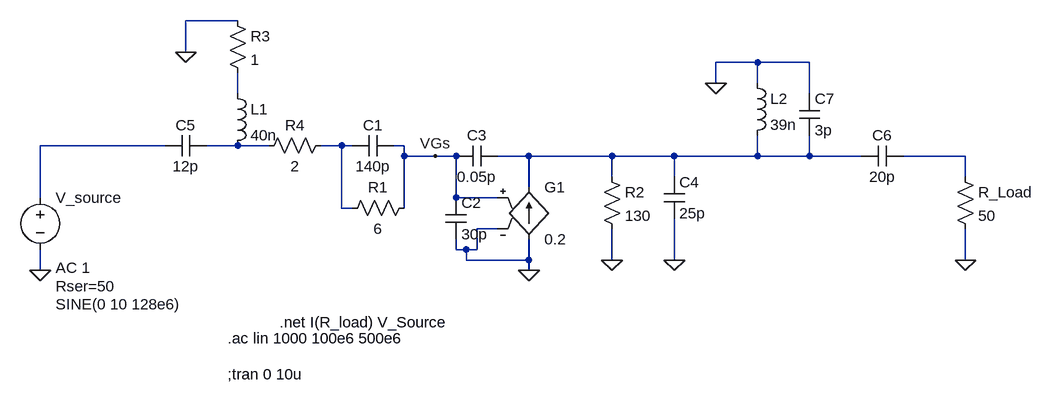
[diagram p0: schematic Stage2_MRFE6VS25N_Linear_Model.asc]
Stage2_MRFE6VS25N_Linear_Model.asc, the LTspice schematic file:
Version 4
SHEET 1 1280 680
WIRE 48 -144 -32 -144
WIRE -32 -96 -32 -144
WIRE 848 -80 784 -80
WIRE 928 -80 848 -80
WIRE 784 -48 784 -80
WIRE 848 -48 848 -80
WIRE 48 -32 48 -64
WIRE 928 -32 928 -80
WIRE -64 48 -256 48
WIRE 48 48 0 48
WIRE 96 48 48 48
WIRE 208 48 176 48
WIRE 224 48 208 48
WIRE 304 48 288 48
WIRE 304 64 304 48
WIRE 352 64 304 64
WIRE 384 64 352 64
WIRE 496 64 448 64
WIRE 624 64 496 64
WIRE 720 64 624 64
WIRE 848 64 848 32
WIRE 848 64 720 64
WIRE 928 64 928 32
WIRE 928 64 848 64
WIRE 1008 64 928 64
WIRE 1168 64 1072 64
WIRE 624 96 624 64
WIRE 720 96 720 64
WIRE 1168 96 1168 64
WIRE 496 112 496 64
WIRE -256 128 -256 48
WIRE 384 128 384 64
WIRE 448 128 384 128
WIRE 208 144 208 48
WIRE 224 144 208 144
WIRE 304 144 304 64
WIRE 448 176 416 176
WIRE 384 208 384 192
WIRE 400 208 384 208
WIRE 416 208 416 176
WIRE 416 208 400 208
WIRE 400 224 400 208
WIRE 496 224 496 192
WIRE 496 224 400 224
WIRE 624 224 624 176
WIRE 720 224 720 160
WIRE 1168 224 1168 176
WIRE -256 240 -256 208
WIRE 496 240 496 224
FLAG -256 240 0
FLAG 496 240 0
FLAG 624 224 0
FLAG 720 224 0
FLAG 1168 224 0
FLAG 352 64 VGs
FLAG -32 -96 0
FLAG 784 -48 0
SYMBOL voltage -256 112 R0
WINDOW 3 24 180 Left 2
WINDOW 123 24 124 Left 2
WINDOW 39 24 152 Left 2
SYMATTR Value SINE(0 10 128e6)
SYMATTR Value2 AC 1
SYMATTR SpiceLine Rser=50
SYMATTR InstName V_source
SYMBOL cap 288 32 R90
WINDOW 0 0 32 VBottom 2
WINDOW 3 32 32 VTop 2
SYMATTR InstName C1
SYMATTR Value 140p
SYMBOL res 320 128 R90
WINDOW 0 0 56 VBottom 2
WINDOW 3 32 56 VTop 2
SYMATTR InstName R1
SYMATTR Value 6
SYMBOL cap 368 128 R0
SYMATTR InstName C2
SYMATTR Value 30p
SYMBOL cap 448 48 R90
WINDOW 0 0 32 VBottom 2
WINDOW 3 32 32 VTop 2
SYMATTR InstName C3
SYMATTR Value 0.05p
SYMBOL res 608 80 R0
SYMATTR InstName R2
SYMATTR Value 130
SYMBOL cap 704 96 R0
SYMATTR InstName C4
SYMATTR Value 25p
SYMBOL res 1152 80 R0
SYMATTR InstName R_Load
SYMATTR Value 50
SYMBOL g 496 96 R0
SYMATTR InstName G1
SYMATTR Value 0.2
SYMBOL ind 32 -48 R0
SYMATTR InstName L1
SYMATTR Value 40n
SYMBOL cap 0 32 R90
WINDOW 0 0 32 VBottom 2
WINDOW 3 32 32 VTop 2
SYMATTR InstName C5
SYMATTR Value 12p
SYMBOL ind 832 -64 R0
SYMATTR InstName L2
SYMATTR Value 39n
SYMBOL cap 1072 48 R90
WINDOW 0 0 32 VBottom 2
WINDOW 3 32 32 VTop 2
SYMATTR InstName C6
SYMATTR Value 20p
SYMBOL res 32 -160 R0
SYMATTR InstName R3
SYMATTR Value 1
SYMBOL res 192 32 R90
WINDOW 0 0 56 VBottom 2
WINDOW 3 32 56 VTop 2
SYMATTR InstName R4
SYMATTR Value 2
SYMBOL cap 912 -32 R0
SYMATTR InstName C7
SYMATTR Value 3p
TEXT 112 320 Left 2 !.net I(R_load) V_Source
TEXT 32 344 Left 2 !.ac lin 1000 100e6 500e6
TEXT 32 400 Left 2 !;tran 0 10u

The netlist it stands for:
* Stage2_MRFE6VS25N_Linear_Model.asc
V_source N002 0 SINE(0 10 128e6) AC 1 Rser=50
C1 VGs N004 140p
R1 VGs N004 6
C2 VGs 0 30p
C3 N005 VGs 0.05p
R2 N005 0 130
C4 N005 0 25p
R_Load N006 0 50
G1 0 N005 VGs 0 0.2
L1 N001 N003 40n
C5 N003 N002 12p
L2 0 N005 39n
C6 N006 N005 20p
R3 0 N001 1
R4 N004 N003 2
C7 0 N005 3p
.net I(R_load) V_Source
.ac lin 1000 100e6 500e6
;tran 0 10u
.backanno
.end